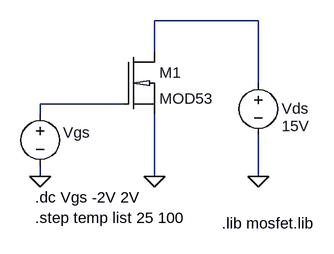
[diagram p0: schematic trans-1-1-3.asc]
trans-1-1-3.asc, the LTspice schematic file:
Version 4
SHEET 1 1292 680
WIRE -560 -176 -720 -176
WIRE -720 -128 -720 -176
WIRE -560 -80 -560 -176
WIRE -768 -48 -896 -48
WIRE -896 -32 -896 -48
WIRE -896 64 -896 48
WIRE -720 64 -720 -32
WIRE -560 64 -560 0
FLAG -560 64 0
FLAG -896 64 0
FLAG -720 64 0
SYMBOL voltage -560 -96 R0
WINDOW 123 0 0 Left 2
WINDOW 39 37 60 Left 2
WINDOW 0 36 55 Left 2
WINDOW 3 36 82 Left 2
SYMATTR InstName Vds
SYMATTR Value 15V
SYMBOL voltage -896 -48 R0
WINDOW 123 0 0 Left 2
WINDOW 39 40 53 Left 2
WINDOW 3 -97 181 Left 2
WINDOW 0 35 44 Left 2
SYMATTR Value ""
SYMATTR InstName Vgs
SYMBOL nmosd -768 -128 R0
SYMATTR InstName M1
SYMATTR Value MOD53
TEXT -904 96 Left 2 !.dc Vgs -2V 2V
TEXT -616 136 Left 2 !.lib mosfet.lib
TEXT -904 128 Left 2 !.step temp list 25 100

The netlist it stands for:
* trans-1-1-3.asc
Vds N001 0 15V
Vgs N002 0
M1 N001 N002 0 0 MOD53
.model NMOS NMOS
.model PMOS PMOS
.lib standard.mos
.dc Vgs -2V 2V
.lib mosfet.lib
.step temp list 25 100
.backanno
.end